# Altium schematic sheet 00_Mounting_Overview.SchDoc: SYSTEM HIERARCHY
size A4; Author: Henrique Rosa; DrawnBy: Henq / Codex; Engineer: Henrique Rosa; Address1: rua; Address: Bairro; Address3: São Paulo, SP - Brasil; Address4: 55 (11) 9 6825-6715; DocumentNumber: GBS-00; Revision: A; SheetNumber: 01; SheetTotal: 06; Site: henq.com; VersionControl_RevNumber: 03; PageSetup: Record=PageOptions|CenterHorizontal=True|CenterVertical=True|PrintScale=0.98|XCorrection=1.00|YCorrection=1.00|PrintKind=0|BorderSize=5000000|LeftOffset=0|BottomOffset=0|Orientation=2|PaperLength=1000|PaperWidth=1000|Scale=100|PaperSource=7|PrintQuality=-3|MediaType=1|DitherType=10|PrintScaleMode=1|PaperKind=A4|PaperIndex=9
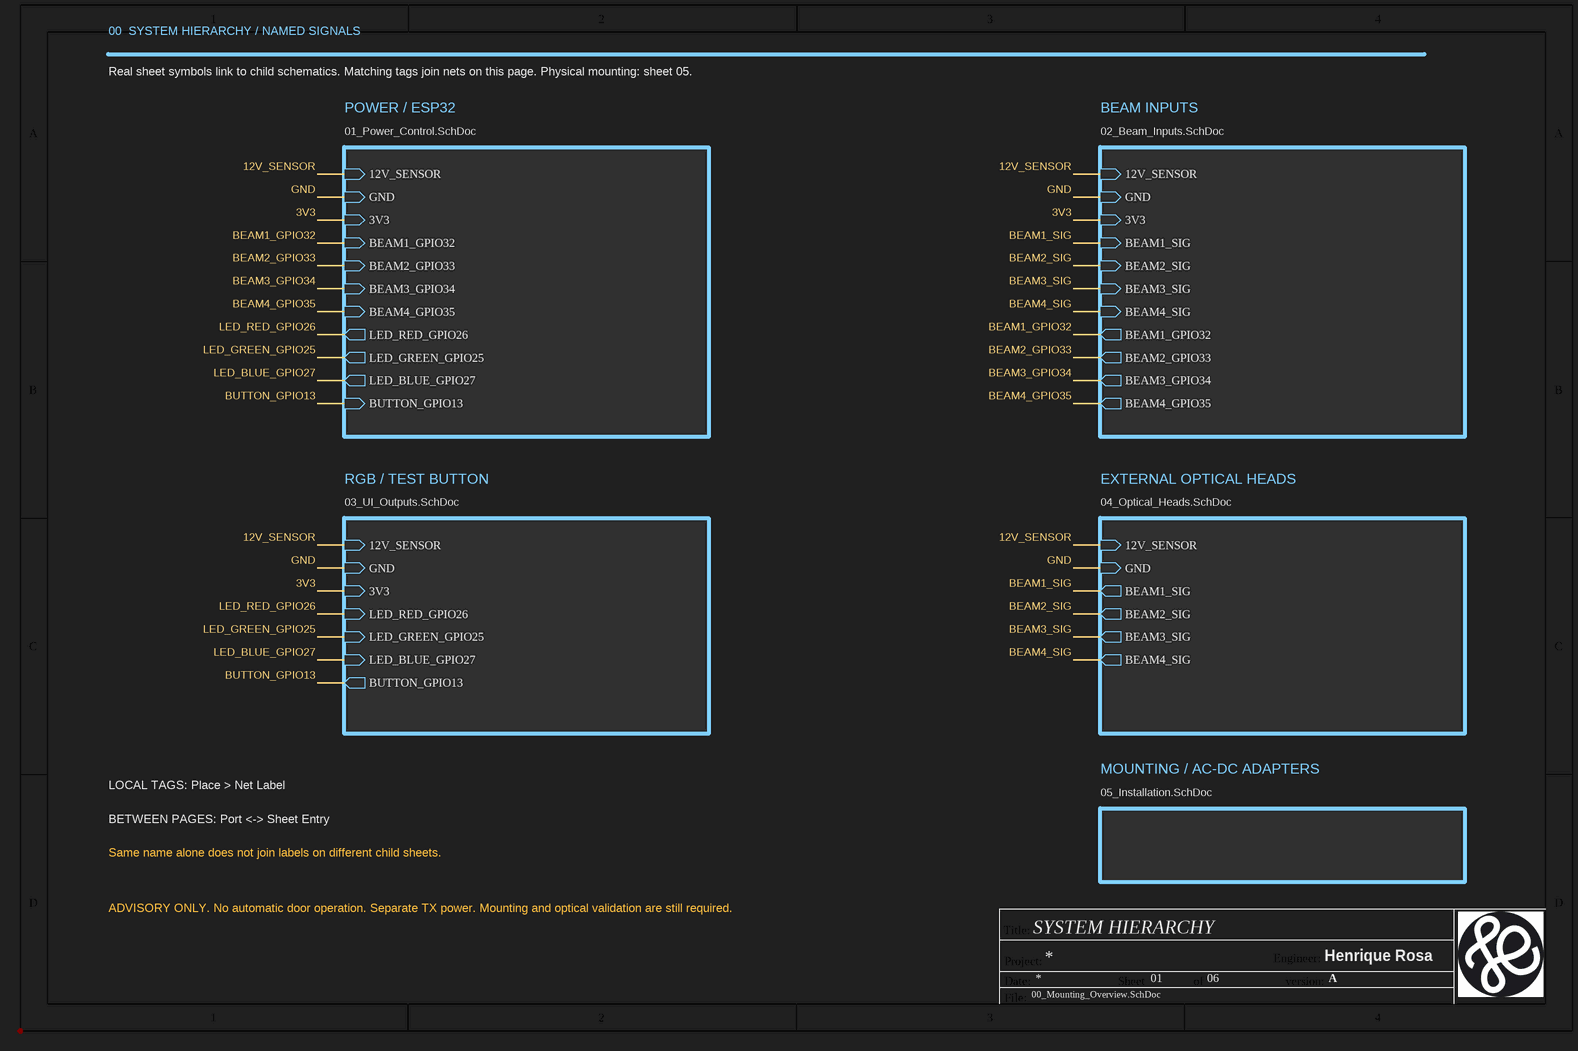
[diagram p0: 00_Mounting_Overview.SchDoc]

## Sub-sheets
BEAM INPUTS = 02_Beam_Inputs.SchDoc: 12V_SENSOR, GND, 3V3, BEAM1_SIG (in), BEAM2_SIG (in), BEAM3_SIG (in), BEAM4_SIG (in), BEAM1_GPIO32 (out), BEAM2_GPIO33 (out), BEAM3_GPIO34 (out), BEAM4_GPIO35 (out)
EXTERNAL OPTICAL HEADS = 04_Optical_Heads.SchDoc: 12V_SENSOR, GND, BEAM1_SIG (out), BEAM2_SIG (out), BEAM3_SIG (out), BEAM4_SIG (out)
MOUNTING / AC-DC ADAPTERS = 05_Installation.SchDoc: no entries
POWER / ESP32 = 01_Power_Control.SchDoc: 12V_SENSOR, GND, 3V3, BEAM1_GPIO32 (in), BEAM2_GPIO33 (in), BEAM3_GPIO34 (in), BEAM4_GPIO35 (in), LED_RED_GPIO26 (out), LED_GREEN_GPIO25 (out), LED_BLUE_GPIO27 (out), BUTTON_GPIO13 (in)
RGB / TEST BUTTON = 03_UI_Outputs.SchDoc: 12V_SENSOR, GND, 3V3, LED_RED_GPIO26 (in), LED_GREEN_GPIO25 (in), LED_BLUE_GPIO27 (in), BUTTON_GPIO13 (out)

## Nets
3V3: sheet POWER / ESP32/3V3, sheet BEAM INPUTS/3V3, sheet RGB / TEST BUTTON/3V3
12V_SENSOR: sheet POWER / ESP32/12V_SENSOR, sheet BEAM INPUTS/12V_SENSOR, sheet RGB / TEST BUTTON/12V_SENSOR, sheet EXTERNAL OPTICAL HEADS/12V_SENSOR
BEAM1_GPIO32: sheet POWER / ESP32/BEAM1_GPIO32, sheet BEAM INPUTS/BEAM1_GPIO32
BEAM1_SIG: sheet BEAM INPUTS/BEAM1_SIG, sheet EXTERNAL OPTICAL HEADS/BEAM1_SIG
BEAM2_GPIO33: sheet POWER / ESP32/BEAM2_GPIO33, sheet BEAM INPUTS/BEAM2_GPIO33
BEAM2_SIG: sheet BEAM INPUTS/BEAM2_SIG, sheet EXTERNAL OPTICAL HEADS/BEAM2_SIG
BEAM3_GPIO34: sheet POWER / ESP32/BEAM3_GPIO34, sheet BEAM INPUTS/BEAM3_GPIO34
BEAM3_SIG: sheet BEAM INPUTS/BEAM3_SIG, sheet EXTERNAL OPTICAL HEADS/BEAM3_SIG
BEAM4_GPIO35: sheet POWER / ESP32/BEAM4_GPIO35, sheet BEAM INPUTS/BEAM4_GPIO35
BEAM4_SIG: sheet BEAM INPUTS/BEAM4_SIG, sheet EXTERNAL OPTICAL HEADS/BEAM4_SIG
BUTTON_GPIO13: sheet POWER / ESP32/BUTTON_GPIO13, sheet RGB / TEST BUTTON/BUTTON_GPIO13
GND: sheet POWER / ESP32/GND, sheet BEAM INPUTS/GND, sheet RGB / TEST BUTTON/GND, sheet EXTERNAL OPTICAL HEADS/GND
LED_BLUE_GPIO27: sheet POWER / ESP32/LED_BLUE_GPIO27, sheet RGB / TEST BUTTON/LED_BLUE_GPIO27
LED_GREEN_GPIO25: sheet POWER / ESP32/LED_GREEN_GPIO25, sheet RGB / TEST BUTTON/LED_GREEN_GPIO25
LED_RED_GPIO26: sheet POWER / ESP32/LED_RED_GPIO26, sheet RGB / TEST BUTTON/LED_RED_GPIO26

## Notes on the sheet
- 00  SYSTEM HIERARCHY / NAMED SIGNALS
- Real sheet symbols link to child schematics. Matching tags join nets on this page. Physical mounting: sheet 05.
- LOCAL TAGS: Place > Net Label
- BETWEEN PAGES: Port <-> Sheet Entry
- Same name alone does not join labels on different child sheets.
- ADVISORY ONLY. No automatic door operation. Separate TX power. Mounting and optical validation are still required.
- Title:
- Project:
- Date:
- Sheet
- of
- Engineer:
- version:
- File:
- Title
- Size:
- A4
- Number:
- Time:
- Revision: